# Altium schematic sheet 1_主控电路.schdoc
size 708 x 330 mm; Name: A_A3; Symbol: A_A3; Device: A_A3; @Project Name: LED点阵最终版; REV: 1.0; Date: 2023-05-17; Sheet: 1/1; Draw By: threeswords; Company: Your Company; Convert to PCB: yes; Add into BOM: yes; @Page No: 1; @Page Count: 1; @Schematic Name: LED点阵; @Update Date: 2023-06-25; @Page Name: 主控电路; @Create Date: 2023-06-21
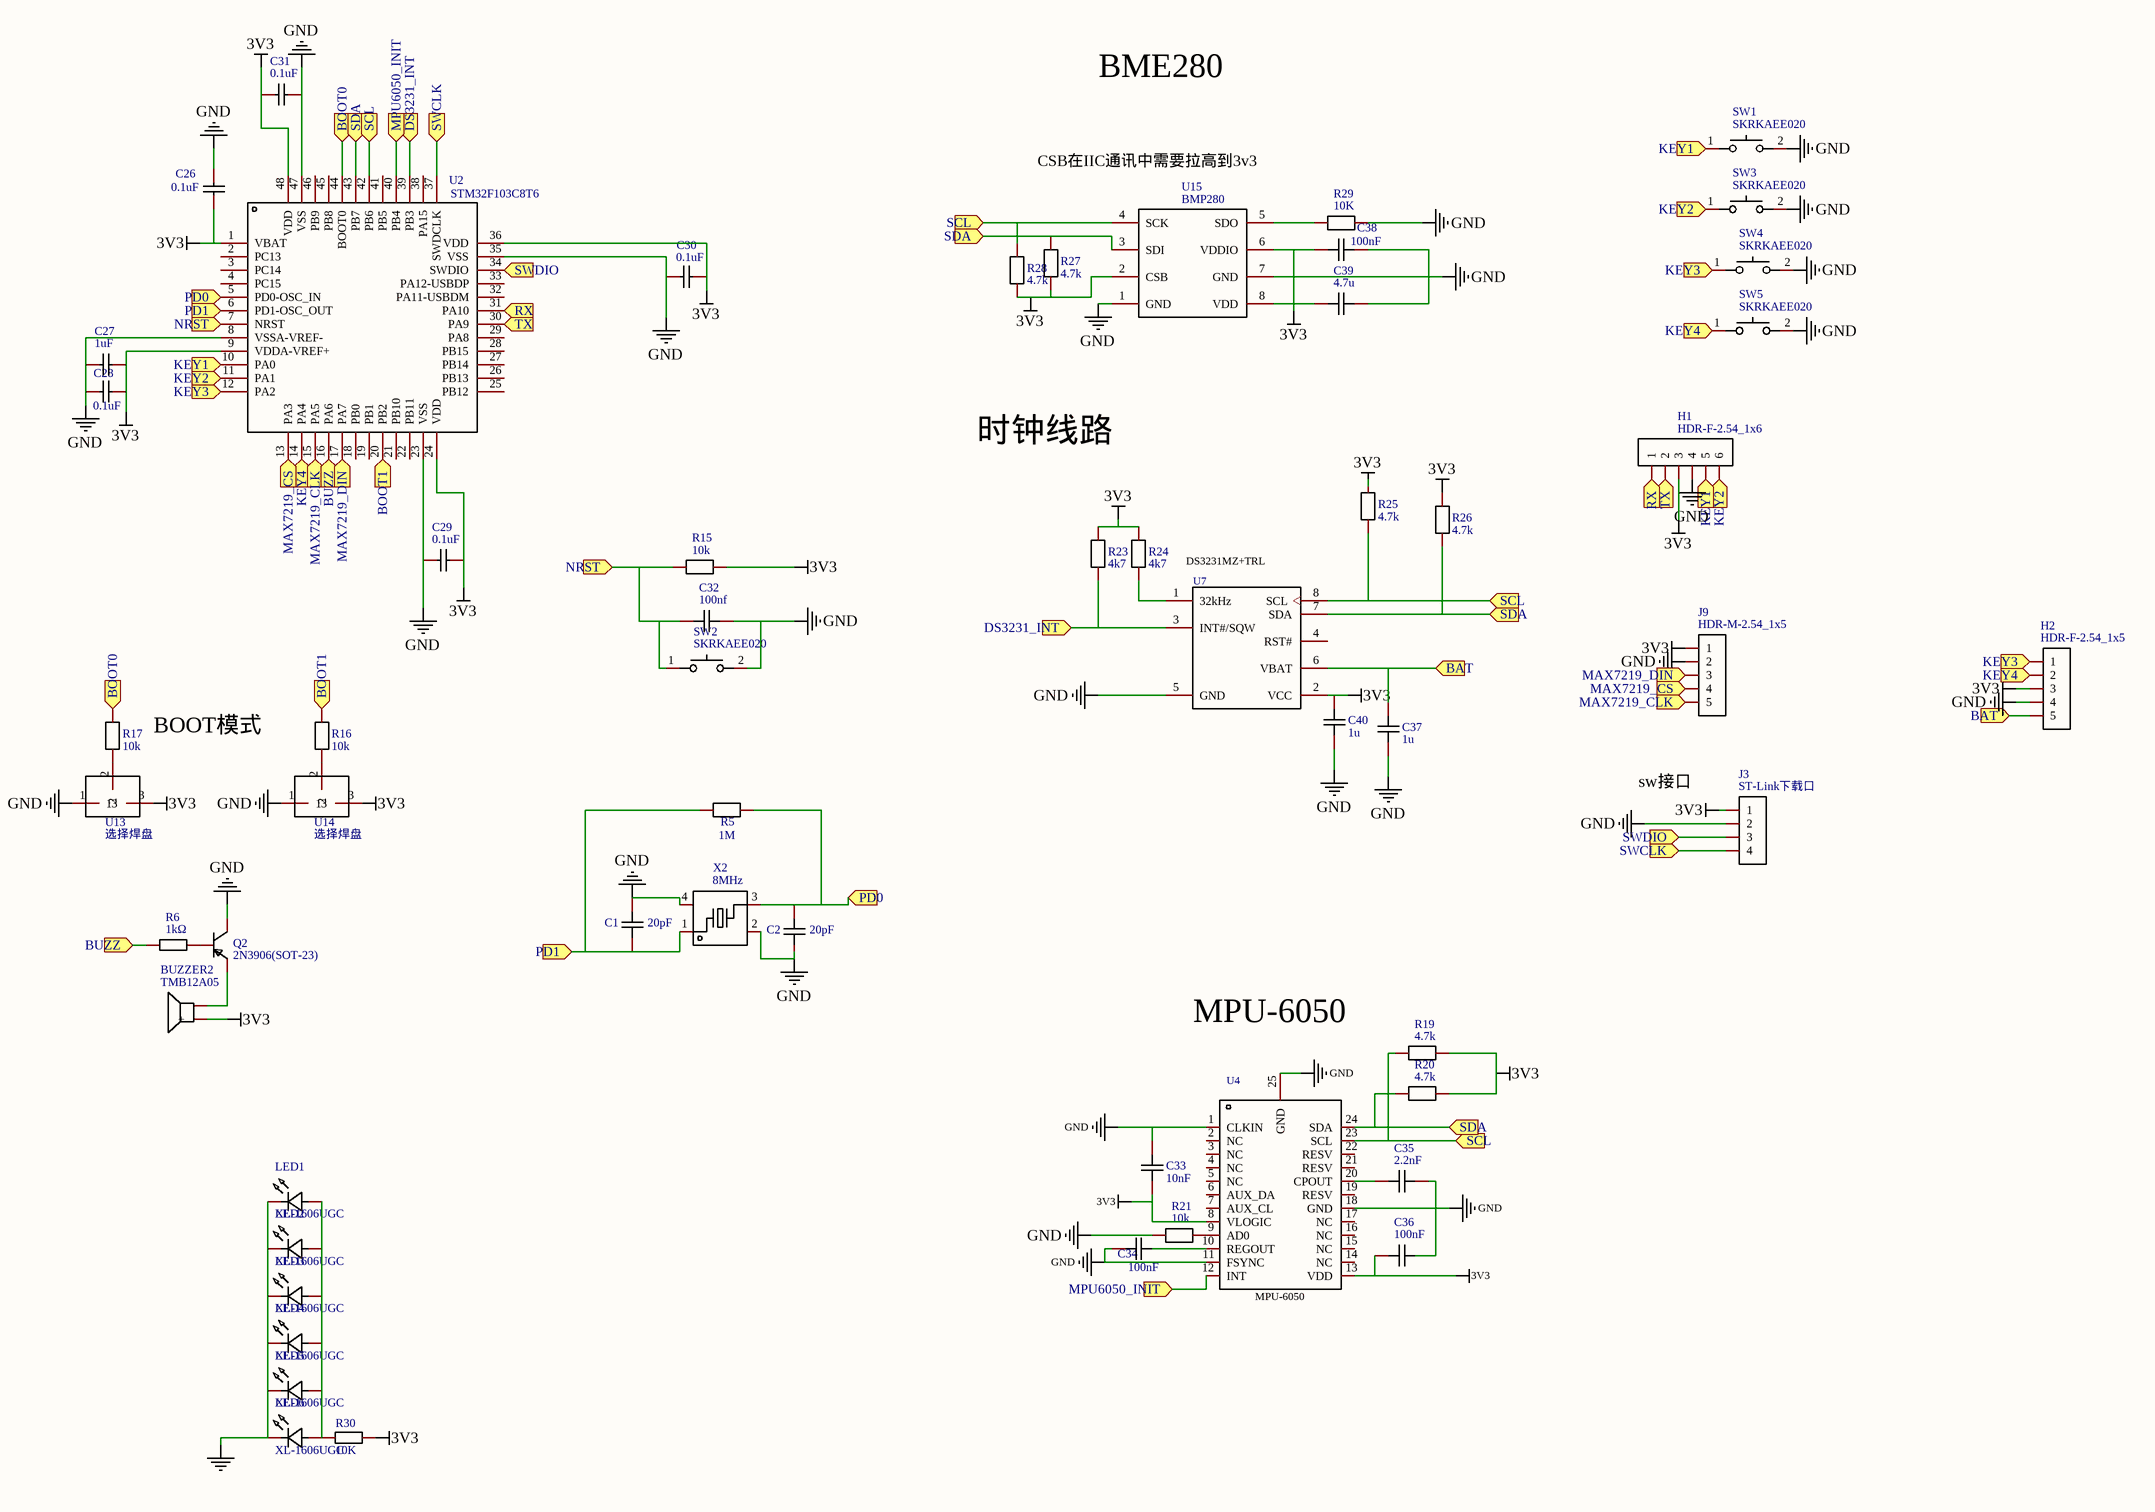
[diagram p0: 1_主控电路.schdoc]

## Parts
1M  R5  [R0603]
BUZZER2  TMB12A05  [BUZ-TH_BD12.0-P7.60-D0.6-FD]
C1  20pF  [C0603]
C2  20pF  [C0603]
C26  0.1uF  [C  0603]
C27  1uF  [C  0603]
C28  0.1uF  [C  0603]
C29  0.1uF  [C  0603]
C30  0.1uF  [C  0603]
C31  0.1uF  [C  0603]
C32  100nf  [C0603]
C33  10nF  [C0603]
C34  100nF  [C0603]
C35  2.2nF  [C0603]
C36  100nF  [C0603]
C37  1u  [C0603]
C38  100nF  [C0603]
C39  4.7u  [C0603]
C40  1u  [C0603]
H1  HDR-F-2.54_1x6  [HDR-F-2.54_1X6]
H2  HDR-F-2.54_1x5  [HDR-F-2.54_1X5]
J3  ST-Link下载口  [J-LINK下载口]
J9  HDR-M-2.54_1x5  [HDR-M-2.54_1X5]
LED1  XL-1606UGC  [LED-SMD_L1.7-W1.1-R-RD_GREEN]
LED2  XL-1606UGC  [LED-SMD_L1.7-W1.1-R-RD_GREEN]
LED3  XL-1606UGC  [LED-SMD_L1.7-W1.1-R-RD_GREEN]
LED4  XL-1606UGC  [LED-SMD_L1.7-W1.1-R-RD_GREEN]
LED5  XL-1606UGC  [LED-SMD_L1.7-W1.1-R-RD_GREEN]
LED6  XL-1606UGC  [LED-SMD_L1.7-W1.1-R-RD_GREEN]
Q2  2N3906(SOT-23)  [SOT-23-3_L2.9-W1.6-P1.90-LS2.8-TR-CW]
R6  1kΩ  [R0603]
R15  10k  [R0603]
R16  10k  [R0603]
R17  10k  [R0603]
R19  4.7k  [R0603]
R20  4.7k  [R0603]
R21  10k  [R0603]
R23  4k7  [R0603]
R24  4k7  [R0603]
R25  4.7k  [R0603]
R26  4.7k  [R0603]
R27  4.7k  [R0603]
R28  4.7k  [R0603]
R29  10K  [R0603]
R30  10K  [R0603]
SW1  SKRKAEE020  [SW-SMD_L3.9-W3.0-P4.45]
SW2  SKRKAEE020  [SW-SMD_L3.9-W3.0-P4.45]
SW3  SKRKAEE020  [SW-SMD_L3.9-W3.0-P4.45]
SW4  SKRKAEE020  [SW-SMD_L3.9-W3.0-P4.45]
SW5  SKRKAEE020  [SW-SMD_L3.9-W3.0-P4.45]
U2  STM32F103C8T6  [LQFP-48_L7.0-W7.0-P0.50-LS9.0-BL]
U4  MPU-6050  [MPU-6050]  (value not drawn)
U7  DS3231MZ+TRL  [DS3231MZ+TRL]  (value not drawn)
U13  选择焊盘  [选择焊盘]
U14  选择焊盘  [选择焊盘]
U15  BMP280  [WLGA-8_L2.5-W2.0-P0.65-TR_DPS422]
X2  8MHz  [OSC-SMD_4P-L3.2-W2.5-BL]

## Ports
BAT (in), BOOT0 (in), BOOT1 (in), BUZZ (in), DS3231_INT (in), KEY1 (in), KEY2 (in), KEY3 (in), KEY4 (in), MAX7219_CLK (in), MAX7219_CS (in), MAX7219_DIN (in), MPU6050_INIT (in), NRST (in), PD0 (in), PD1 (in), RX (in), SCL (in), SDA (in), SWCLK (in), SWDIO (in), TX (in)

## Nets
3V3: BUZZER2.1(+) C26.2 C27.2 C28.2 C29.1 C30.2 C31.2 C33.1 C36.1 C38.1 C39.1 C40.2 H1.3 H2.3 J3.1 J9.1 R15.2 R19.2 R20.2 R23.2 R24.2 R25.2 R26.2 R27.1 R28.1 R30.2 U2.1(VBAT) U2.9(VDDA-VREF+) U2.24(VDD) U2.36(VDD) U2.48(VDD) U4.8(VLOGIC) U4.13(VDD) U7.2(VCC) U13.3 U14.3 U15.2(CSB) U15.6(VDDIO) U15.8(VDD)
GND: C1.2 C2.1 C26.1 C27.1 C28.1 C29.2 C30.1 C31.1 C32.2 C33.2 C34.1 C35.2 C36.2 C37.1 C38.2 C39.2 C40.1 H1.4 H2.4 J3.2 J9.2 Q2.3(C) R21.1 R29.2 SW1.2 SW2.2 SW3.2 SW4.2 SW5.2 U2.8(VSSA-VREF-) U2.23(VSS) U2.35(VSS) U2.47(VSS) U4.1(CLKIN) U4.11(FSYNC) U4.18(GND) U4.25(GND) U7.5(GND) U13.1 U14.1 U15.1(GND) U15.7(GND) X2.2(GND) X2.4(GND)
NetLED1_2: LED1.2(K) LED2.2(K) LED3.2(K) LED4.2(K) LED5.2(K) LED6.2(K)
BAT: C37.2 H2.5 U7.6(VBAT) ; port BAT
BOOT0: R17.2 U2.44(BOOT0) ; port BOOT0
BOOT1: R16.2 U2.20(PB2) ; port BOOT1
BUZZ: R6.1 U2.16(PA6) ; port BUZZ
DS3231_INT: R23.1 U2.39(PB3) U7.3(INT#/SQW) ; port DS3231_INT
KEY1: H1.5 SW1.1 U2.10(PA0) ; port KEY1
KEY2: H1.6 SW3.1 U2.11(PA1) ; port KEY2
KEY3: H2.1 SW4.1 U2.12(PA2) ; port KEY3
KEY4: H2.2 SW5.1 U2.14(PA4) ; port KEY4
MAX7219_CLK: J9.5 U2.15(PA5) ; port MAX7219_CLK
MAX7219_CS: J9.4 U2.13(PA3) ; port MAX7219_CS
MAX7219_DIN: J9.3 U2.17(PA7) ; port MAX7219_DIN
MPU6050_INIT: U2.40(PB4) U4.12(INT) ; port MPU6050_INIT
NRST: C32.1 R15.1 SW2.1 U2.7(NRST) ; port NRST
PD0: 1M.2 C2.2 U2.5(PD0-OSC_IN) X2.3 ; port PD0
PD1: 1M.1 C1.1 U2.6(PD1-OSC_OUT) X2.1 ; port PD1
RX: H1.1 U2.31(PA10) ; port RX
SCL: R19.1 R25.1 R28.2 U2.42(PB6) U4.23(SCL) U7.8(SCL) U15.4(SCK) ; port SCL
SDA: R20.1 R26.1 R27.2 U2.43(PB7) U4.24(SDA) U7.7(SDA) U15.3(SDI) ; port SDA
SWCLK: J3.4 U2.37(SWDCLK) ; port SWCLK
SWDIO: J3.3 U2.34(SWDIO) ; port SWDIO
TX: H1.2 U2.30(PA9) ; port TX
NetBUZZER2_2: BUZZER2.2 Q2.1(E)
NetC34_2: C34.2 U4.10(REGOUT)
NetC35_1: C35.1 U4.20(CPOUT)
NetLED1_1: LED1.1(A) LED2.1(A) LED3.1(A) LED4.1(A) LED5.1(A) LED6.1(A) R30.1
NetQ2_2: Q2.2(B) R6.2
NetR16_1: R16.1 U14.2
NetR17_1: R17.1 U13.2
NetR21_2: R21.2 U4.9(AD0)
NetR24_1: R24.1 U7.1(32kHz)
NetR29_1: R29.1 U15.5(SDO)

Not connected (* = marked no-connect by the designer): U2 2(PC13) 3(PC14) 4(PC15) 18(PB0) 19(PB1) 21(PB10) 22(PB11) 25(PB12) 26(PB13) 27(PB14) 28(PB15) 29(PA8) 32(PA11-USBDM) 33(PA12-USBDP) 38(PA15) 41(PB5) 45(PB8) 46(PB9); U4 2(NC) 3(NC) 4(NC) 5(NC) 6(AUX_DA) 7(AUX_CL) 14(NC) 15(NC) 16(NC) 17(NC) 19(RESV) 21(RESV) 22(RESV); U7 4(RST#)

## Notes on the sheet
- BME280
- CSB在IIC通讯中需要拉高到3v3
- 时钟线路
- BOOT模式
- sw接口
- MPU-6050
- 1
- 2
- 3
- 4
- 5
- 6
- 7
- 8
- A
- B
- C
- D
- E
- TITLE:
- LED点阵最终版
- REV:
- 1.0
- Date:
- Company:
- 2023-05-17
- Your Company
- Drawn By:
- threeswords
- Sheet:
- 1/1
- LED点阵
- 2023-06-25
- 主控电路
- 2023-06-21

## Library data of the parts
1M = R5: Convert to PCB: yes; Name: R5; Symbol: R5; Device: R5; Add into BOM: yes; Origin Footprint: R0603
BUZZER2 = TMB12A05: Manufacturer: HNDZ; Frequency: 2300Hz; Convert to PCB: yes; Name: TMB12A05; Symbol: TMB12A05; Device: TMB12A05; Supplier: LCSC; Manufacturer Part: TMB12A05; Supplier Part: C96093; JLCPCB Part Class: ExtendedPart; Add into BOM: yes; Origin Footprint: BUZ-TH_BD12.0-P7.60-D0.6-FD
C1 C2 = 20pF: Convert to PCB: yes; Name: 20pF; Symbol: 20pF; Device: 20pF; Add into BOM: yes; Origin Footprint: C0603
C26 C28-C31 = TCC0603X7R104K500CT: Manufacturer: CCTC; Convert to PCB: yes; Name: 0.1uF; Symbol: 0.1uF; Device: TCC0603X7R104K500CT; Manufacturer Part: TCC0603X7R104K500CT; Supplier: LCSC; Supplier Part: C282519; Add into BOM: yes; Origin Footprint: C  0603
C27 = TCC0603X7R104K500CT: Manufacturer: CCTC; Symbol: 0.1uF; Convert to PCB: yes; Name: 1uF; Device: TCC0603X7R104K500CT; Manufacturer Part: TCC0603X7R104K500CT; Supplier: LCSC; Supplier Part: C282519; Add into BOM: yes; Origin Footprint: C  0603
C32 = 100nf: Convert to PCB: yes; Name: 100nf; Symbol: 100nf; Device: 100nf; Add into BOM: yes; Origin Footprint: C0603
C33 = 10nF: Convert to PCB: yes; Name: 10nF; Symbol: 10nF; Device: 10nF; Add into BOM: yes; Origin Footprint: C0603
C34 C36 C38 = 100nF: Convert to PCB: yes; Name: 100nF; Symbol: 100nF; Device: 100nF; Add into BOM: yes; Origin Footprint: C0603
C35 = 2.2nF: Convert to PCB: yes; Name: 2.2nF; Symbol: 2.2nF; Device: 2.2nF; Add into BOM: yes; Origin Footprint: C0603
C37 C40 = 1u: Convert to PCB: yes; Name: 1u; Symbol: 1u; Device: 1u; Add into BOM: yes; Origin Footprint: C0603
C39 = 4.7u: Convert to PCB: yes; Name: 4.7u; Symbol: 4.7u; Device: 4.7u; Add into BOM: yes; Origin Footprint: C0603
H1 = HDR-F-2.54_1x6: Convert to PCB: yes; Name: HDR-F-2.54_1x6; Symbol: HDR-F-2.54_1x6; Device: HDR-F-2.54_1x6; Supplier Part: C40877; Supplier: LCSC; Add into BOM: yes; Origin Footprint: HDR-F-2.54_1X6
H2 = HDR-F-2.54_1x5: Convert to PCB: yes; Name: HDR-F-2.54_1x5; Symbol: HDR-F-2.54_1x5; Device: HDR-F-2.54_1x5; Supplier Part: C50950; Supplier: LCSC; Add into BOM: yes; Origin Footprint: HDR-F-2.54_1X5
J3 = ST-Link下载口: Convert to PCB: yes; Name: ST-Link下载口; Symbol: ST-Link下载口; Device: ST-Link下载口; Add into BOM: yes; Origin Footprint: J-LINK下载口
J9 = HDR-M-2.54_1x5: Convert to PCB: yes; Name: HDR-M-2.54_1x5; Symbol: HDR-M-2.54_1x5; Device: HDR-M-2.54_1x5; Supplier Part: C358687; Supplier: LCSC; Add into BOM: yes; Origin Footprint: HDR-M-2.54_1X5
LED1-LED6 = XL-1606UGC: 发光颜色:翠绿;主波长:520nm~530nm;色温:-;功率:80mW;安装方式:侧贴;; Manufacturer: XINGLIGHT(成兴光); Add into BOM: yes; Emitted Color: 翠绿; Lens Color: 无色透明; Peak Wavelength: 535nm; Forward Current: 25mA; Power Dissipation: 80mW; Viewing Angle: 120°; Mounting Sytle: 侧贴; Name: XL-1606UGC; Symbol: XL-1606UGC; Device: XL-1606UGC; LCSC Part Name: 翠绿 侧贴; Supplier Part: C965863; Manufacturer Part: XL-1606UGC; Supplier Footprint: SMD,1.1x1.7mm; JLCPCB Part Class: 扩展库; Datasheet: https://atta.szlcsc.com/upload/public/pdf/source/20221102/94FA3AB05D9E652787BBD0AFAAE97065.pdf; Supplier: LCSC; Convert to PCB: yes; Dominant Wavelength: 520nm~530nm; Color Temperature: -; Operating Temperature: -30℃~+85℃
Q2 = 2N3906S-RTK/PS: Manufacturer: KEC; Convert to PCB: yes; Name: 2N3906(SOT-23); Symbol: 2N3906(SOT-23); Device: 2N3906S-RTK/PS; Supplier: LCSC; Manufacturer Part: 2N3906S-RTK/PS; Supplier Part: C147294; Add into BOM: yes; Origin Footprint: SOT-23-3_L2.9-W1.6-P1.90-LS2.8-TR-CW
R6 = RS-03K102JT: Manufacturer: FH; Resistance: 1K; Convert to PCB: yes; Name: 1kΩ; Symbol: 1kΩ; Device: RS-03K102JT; Supplier: LCSC; Manufacturer Part: RS-03K102JT; Supplier Part: C73797; JLCPCB Part Class: ExtendedPart; Add into BOM: yes; Origin Footprint: R0603
R15-R17 R21 = 10k: Convert to PCB: yes; Name: 10k; Symbol: 10k; Device: 10k; Add into BOM: yes; Origin Footprint: R0603
R19 R20 R25-R28 = 4.7k: Convert to PCB: yes; Name: 4.7k; Symbol: 4.7k; Device: 4.7k; Add into BOM: yes; Origin Footprint: R0603
R23 R24 = 4k7: Convert to PCB: yes; Name: 4k7; Symbol: 4k7; Device: 4k7; Add into BOM: yes; Origin Footprint: R0603
R29 = 10K: Convert to PCB: yes; Name: 10K; Symbol: 10K; Device: 10K; Add into BOM: yes; Origin Footprint: R0603
R30 = Res_0603: Symbol: 电阻; Convert to PCB: yes; Name: 10K; Device: Res_0603; Add into BOM: yes; Supplier Footprint: 0603; Value: 10K
SW1-SW5 = SKRKAEE020: Manufacturer: ALPSALPINE(阿尔卑斯阿尔派); Convert to PCB: yes; Name: SKRKAEE020; Symbol: SKRKAEE020; Device: SKRKAEE020; Supplier: LCSC; Manufacturer Part: SKRKAEE020; Supplier Part: C115357; JLCPCB Part Class: ExtendedPart; Add into BOM: yes; Origin Footprint: SW-SMD_L3.9-W3.0-P4.45
U2 = MM32F103C8T6: Manufacturer: MindMotionMicroelectronics; Convert to PCB: yes; Name: STM32F103C8T6; Symbol: STM32F103C8T6; Device: MM32F103C8T6; Supplier: LCSC; Supplier Part: C212243; Manufacturer Part: MM32F103C8T6; JLCPCB Part Class: Extend; Add into BOM: yes; Origin Footprint: LQFP-48_L7.0-W7.0-P0.50-LS9.0-BL; NO_CONNECT: yes
U4 = MPU-6050: 三轴加速度计和三轴陀螺仪，工作电压：2.375V3.46V; Manufacturer: TDK InvenSense(应美盛); Add into BOM: yes; Origin Footprint: QFN-24_L4.0-W4.0-P0.50-BL-EP2.7; Name: MPU-6050; Symbol: MPU-6050; Device: MPU-6050; LCSC Part Name: MPU-6050; Supplier Part: C24112; Manufacturer Part: MPU-6050; Supplier Footprint: QFN-24_4x4x05P; JLCPCB Part Class: Extended Part; Datasheet: https://atta.szlcsc.com/upload/public/pdf/source/20140425/1457707046159.pdf; Supplier: LCSC; Convert to PCB: yes; NO_CONNECT: yes
U7 = DS3231MZ+TRL: 时钟芯片类型:Clock/Calendar;存储器容量:-;时间格式:HH:MM:SS (12/24 hr);日期格式:YY-MM-DD-dd;接口类型:I2C, 2-Wire Serial;; Manufacturer: MAXIM(美信); Add into BOM: yes; Voltage - Supply: 2.3V  5.5V; Current - Timekeeping (Max): 130A  200A @ 3.63V  5.5V; Origin Footprint: SOIC-8_L4.9-W3.9-P1.27-LS6.0-BL-EP3.4; Name: DS3231MZ+TRL; Symbol: DS3231MZ+TRL; Device: DS3231MZ+TRL; LCSC Part Name: DS3231MZRL; Supplier Part: C107410; Manufacturer Part: DS3231MZ+TRL; Supplier Footprint: SOIC-8_150mil; JLCPCB Part Class: Extended Part; Datasheet: https://atta.szlcsc.com/upload/public/pdf/source/20170620/1497944726830.pdf; Supplier: LCSC; Convert to PCB: yes; Type: Clock/Calendar; Features: Alarm, Leap Year, Square Wave Output; Memory Size: -; Time Format: HH:MM:SS (12/24 hr); Date Format: YY-MM-DD-dd; Interface: I2C, 2-Wire Serial; Voltage - Supply, Battery: 2.3V  5.5V; NO_CONNECT: yes
U13 U14 = 选择焊盘: Convert to PCB: yes; Name: 选择焊盘; Symbol: 选择焊盘; Device: 选择焊盘; Add into BOM: yes; Origin Footprint: 选择焊盘
U15 = BMP280: Manufacturer: Bosch(博世); Convert to PCB: yes; Name: BMP280; Symbol: BMP280; Device: BMP280; Supplier: LCSC; Manufacturer Part: BMP280; Supplier Part: C83291; JLCPCB Part Class: ExtendedPart; Add into BOM: yes; Origin Footprint: WLGA-8_L2.5-W2.0-P0.65-TR_DPS422
X2 = X32258MOB4SI: Manufacturer: YXC(扬兴晶振); Convert to PCB: yes; Name: 8MHz; Symbol: 8MHz; Device: X32258MOB4SI; Supplier: LCSC; Supplier Part: C2682775; Manufacturer Part: X32258MOB4SI; JLCPCB Part Class: ExtendedPart; Add into BOM: yes; Origin Footprint: OSC-SMD_4P-L3.2-W2.5-BL